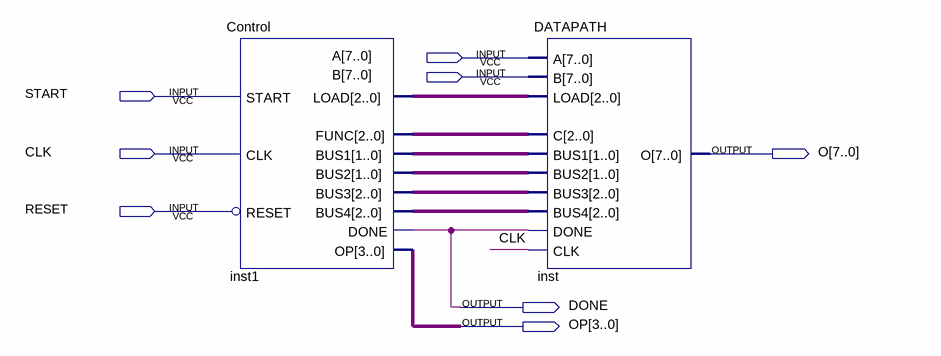
[diagram p0: schematic sheet]
// Quartus schematic piprline.bdf as structural Verilog: 2 symbols, 8 pins
module piprline (
  input  [7:0] A,
  input  [7:0] B,
  input  START,
  input  CLK,
  input  RESET,
  output [7:0] O,
  output DONE,
  output [3:0] OP
);

  wire [1:0] inst1_bus1, inst1_bus2;
  wire [2:0] inst1_bus3, inst1_bus4, inst1_func, inst1_load;

  Control inst1 (
    .CLK(CLK), .RESET(~RESET), .START(START), .BUS1(inst1_bus1), .BUS2(inst1_bus2), .BUS3(inst1_bus3),
    .BUS4(inst1_bus4), .DONE(DONE), .FUNC(inst1_func), .LOAD(inst1_load), .OP(OP));
  DATAPATH inst (
    .A(A), .B(B), .LOAD(inst1_load), .C(inst1_func), .BUS1(inst1_bus1), .BUS2(inst1_bus2), .BUS3(inst1_bus3),
    .BUS4(inst1_bus4), .DONE(DONE), .CLK(CLK), .O(O));
endmodule
